# Altium schematic sheet Display_Interface.SchDoc
size A4; SheetNumber: 10; SheetTotal: 12
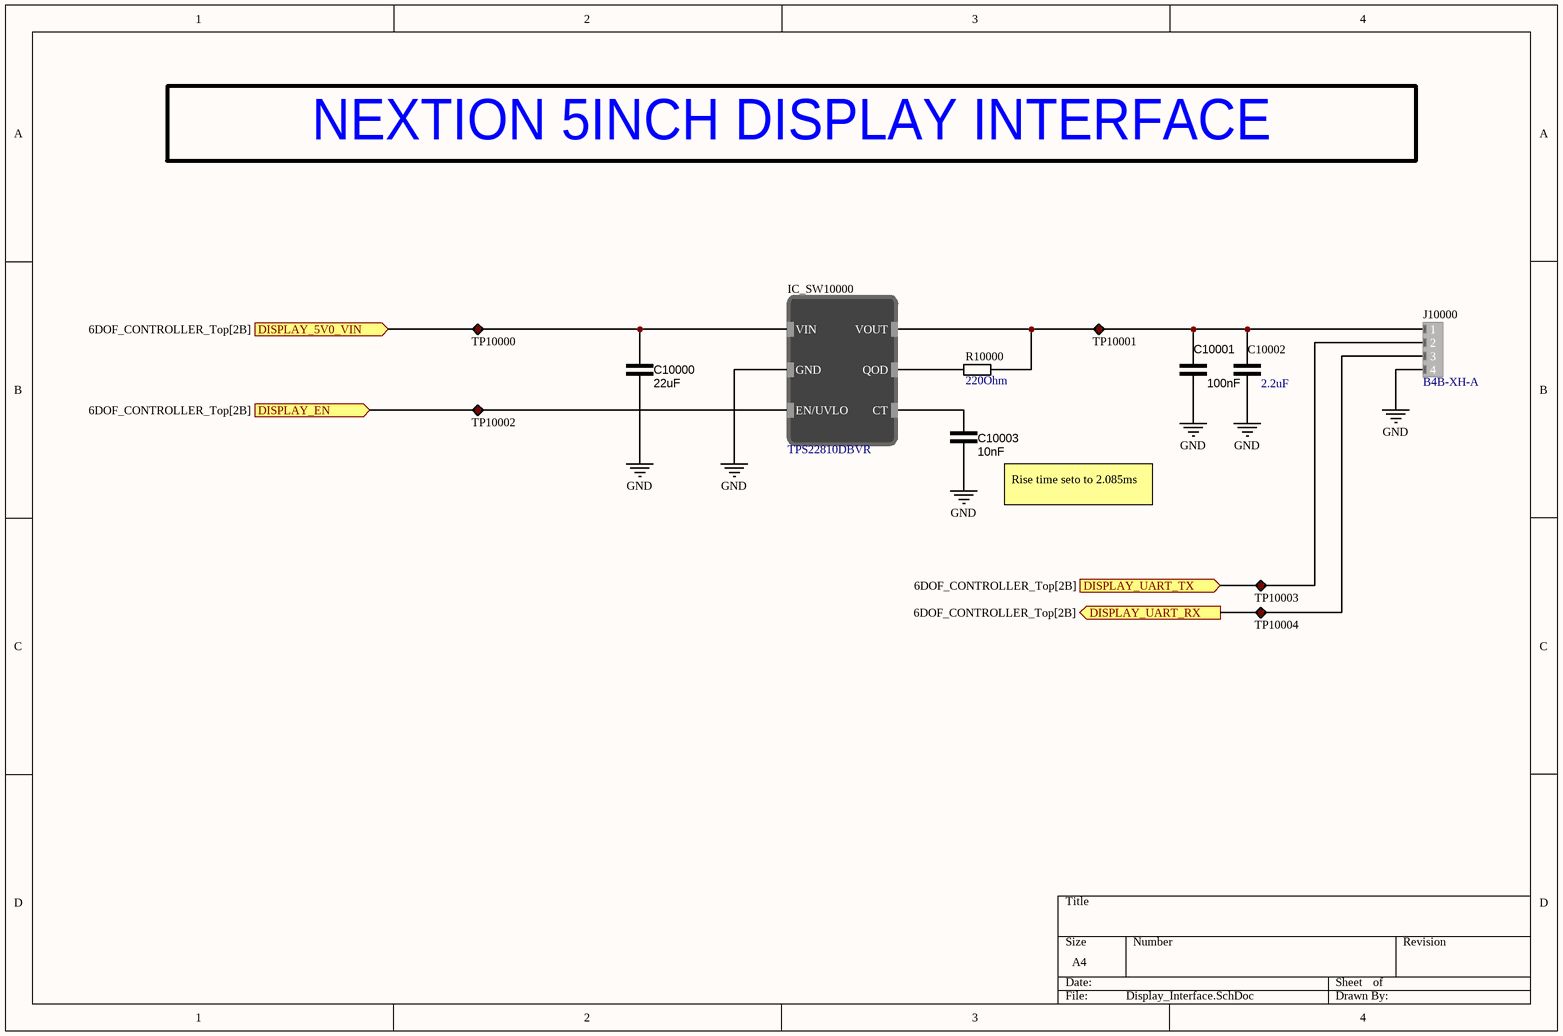
[diagram p0: Display_Interface.SchDoc]

## Parts
C10000  22uF  [CAP_0805]
C10001  100nF  [CAP_0603]
C10002  2.2uF  [CAP_0603]
C10003  10nF  [CAP_0603]
IC_SW10000  TPS22810DBVR  [SOT95P280X145-6N]
J10000  B4B-XH-A  [JST_XH_4POS]
R10000  220Ohm  [RES_0603]
TP10000  Test point  [TestPoint]  (value not drawn)
TP10001  Test point  [TestPoint]  (value not drawn)
TP10002  Test point  [TestPoint]  (value not drawn)
TP10003  Test point  [TestPoint]  (value not drawn)
TP10004  Test point  [TestPoint]  (value not drawn)

## Ports
DISPLAY_5V0_VIN (in, see 6DOF_CONTROLLER_Top[2B]), DISPLAY_EN (in, see 6DOF_CONTROLLER_Top[2B]), DISPLAY_UART_RX (out, see 6DOF_CONTROLLER_Top[2B]), DISPLAY_UART_TX (in, see 6DOF_CONTROLLER_Top[2B])

## Nets
GND: C10000.1 C10001.2 C10002.1 C10003.1 IC_SW10000.2(GND) J10000.4
DISPLAY_5V0_VIN: C10000.2 IC_SW10000.1(VIN) TP10000.1 ; port DISPLAY_5V0_VIN
DISPLAY_EN: IC_SW10000.3(EN/UVLO) TP10002.1 ; port DISPLAY_EN
DISPLAY_UART_RX: J10000.3 TP10004.1 ; port DISPLAY_UART_RX
DISPLAY_UART_TX: J10000.2 TP10003.1 ; port DISPLAY_UART_TX
NetC10001_1: C10001.1 C10002.2 IC_SW10000.6(VOUT) J10000.1 R10000.2 TP10001.1
NetC10003_2: C10003.2 IC_SW10000.4(CT)
NetIC_SW10000_5: IC_SW10000.5(QOD) R10000.1

## Notes on the sheet
- NEXTION 5INCH DISPLAY INTERFACE
- (near C10003) Rise time seto to 2.085ms

## Library data of the parts
C10000 = C000001: 22 µF ±20% 25V Ceramic Capacitor X5R 0805 (2012 Metric); ComponentLink1Description: DigiKey; ComponentLink1URL: https://www.digikey.com/en/products/detail/tdk-corporation/C2012X5R1E226M125AC/3661564; DigiKey Part Number: 445-9112-1-ND; capacitance: 22uF
C10001 = C000007: 0.1 µF ±10% 25V Ceramic Capacitor X7R 0603 (1608 Metric); ComponentLink1Description: DigiKey; ComponentLink1URL: https://www.digikey.com/en/products/detail/kyocera-avx/06033C104K4T2A/8019250; DigiKey Part Number: 478-KAM15AR71E104KTCT-ND; capacitance: 100nF
C10002 = C000014: 8 pF ±0.05pF 25V Ceramic Capacitor C0G, NP0 01005 (0402 Metric); ComponentLink1Description: DigiKey; ComponentLink1URL: https://www.digikey.com/en/products/detail/murata-electronics/GRM188C71C225KE11D/4905311; DigiKey Part Number: 490-12731-1-ND; capacitance: 2.2uF
C10003 = C000005: 10000 pF ±20% 25V Ceramic Capacitor X7R 0603 (1608 Metric); ComponentLink1Description: DigiKey; ComponentLink1URL: https://www.digikey.com/en/products/detail/kyocera-avx/06033C103MAT2A/1599370; DigiKey Part Number: 478-KGM15AR71E103MTCT-ND; capacitance: 10nF
IC_SW10000 = TPS22810: Power Switch/Driver 1:1 N-Channel 2A SOT-23-6; DigiKey Part Number: 296-45297-1-ND; Mouser Part Number: 595-TPS22810DBVR; ComponentLink1Description: DigiKey; ComponentLink1URL: https://www.digikey.com/en/products/detail/texas-instruments/TPS22810DBVR/6595640; ComponentLink2Description: Mouser; ComponentLink2URL: https://eu.mouser.com/ProductDetail/Texas-Instruments/TPS22810DBVR?qs=34RfhUjJmKcFqeJVMZZhPA%3D%3D
J10000 = 00000014: Connector Header Through Hole 4 position 0.098" (2.50mm); DigiKey Part Number: 455-B4B-XH-A-ND; ComponentLink1Description: DigiKey; ComponentLink1URL: https://www.digikey.com/en/products/detail/jst-sales-america-inc/B4B-XH-A/1651047
R10000 = R000021: 220 Ohms ±5% 0.1W, 1/10W Chip Resistor 0603 (1608 Metric) Automotive AEC-Q200 Thick Film; ComponentLink1Description: DigiKey; ComponentLink1URL: https://www.digikey.com/en/products/detail/panasonic-electronic-components/ERJ-3GEYJ221V/135719; resistance: 220Ohm; DigiKey Part Number: P220GCT-ND
TP10000-TP10004 = TP002: Test point 1mm